# Altium schematic sheet Detection Circuit.SchDoc
size A4
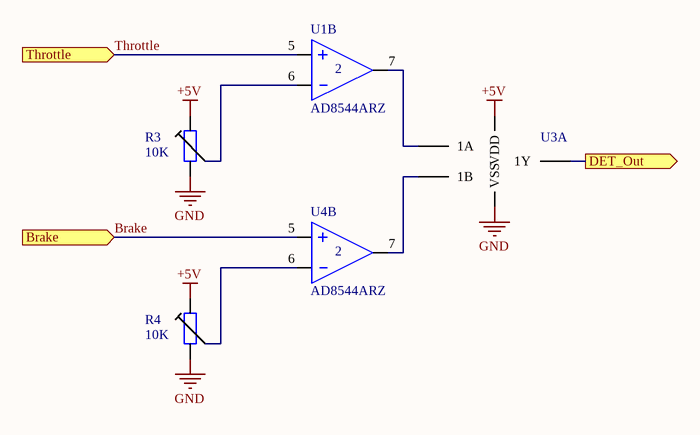
[diagram p0: Detection Circuit.SchDoc]

## Parts
R3  10K  [RESDFN3_475X200X100L160X130N]
R4  10K  [RESDFN3_475X200X100L160X130N]
U1  AD8544ARZ  [SOIC14P127_865X600X175L83X41N]  (part B of 4)
U3  HEF4081BT  [SOIC14P127_865X600X175L70X42N]  (value not drawn)  (part A of 4)
U4  AD8544ARZ  [SOIC14P127_865X600X175L83X41N]  (part B of 4)

## Ports
Brake (in), DET_Out (out), Throttle (in)

## Nets
+5V: R3.3 R4.3 U3.14(VDD)
GND: R3.1 R4.1 U3.7(VSS)
Brake: U4.5 ; port Brake
DET_Out: U3.3(1Y) ; port DET_Out
Throttle: U1.5 ; port Throttle
NetR3_2: R3.2 U1.6
NetR4_2: R4.2 U4.6
NetU1_7: U1.7 U3.1(1A)
NetU3_2: U3.2(1B) U4.7

## Library data of the parts
R3 R4 = Trimmer_10K_0W250: Manufacturer Part Number: PVG5A103C03B00; Power Rating: 250mW; Resistor Case Style: Vertical; Temperature Coefficient: 150 PPM/C; FR_SN: Trim-02; Part Number: Trimmer_10K_0W250; Value: 10K; ComponentLink1Description: Datasheet; Supplier Part Number: 81-PVG5A103C03B00; ComponentLink1URL: https://hr.mouser.com/datasheet/2/54/pvg5-907351.pdf
U1 U4 = AD8544: Manufacturer Part Number: AD8544ARZ-REEL; IC Case Style: SOIC-14; ComponentLinkDescription: Datasheet; FR_SN: U_Analog-15; Part Number: AD8544; Value: AD8544ARZ; Category: OP Amp; ComponentLinkURL: https://hr.mouser.com/datasheet/2/609/AD8541_8542_8544-1502176.pdf; Supplier Part Number: 584-AD8544ARZ-R
U3 = HEF4081BT: Manufacturer Part Number: HEF4081BT,653; IC Case Style: SO-14; ComponentLinkDescription: Datasheet; FR_SN: IC_Misc-20; Part Number: HEF4081BT; Value: HEF4081BT; Category: Logic AND Gate; ComponentLinkURL: https://hr.mouser.com/datasheet/2/916/HEF4081B_Q100-1599374.pdf; Supplier Part Number: 771-HEF4081BTD-T